# EAGLE schematic A-DSP V10 (EAGLE 7.6.0)
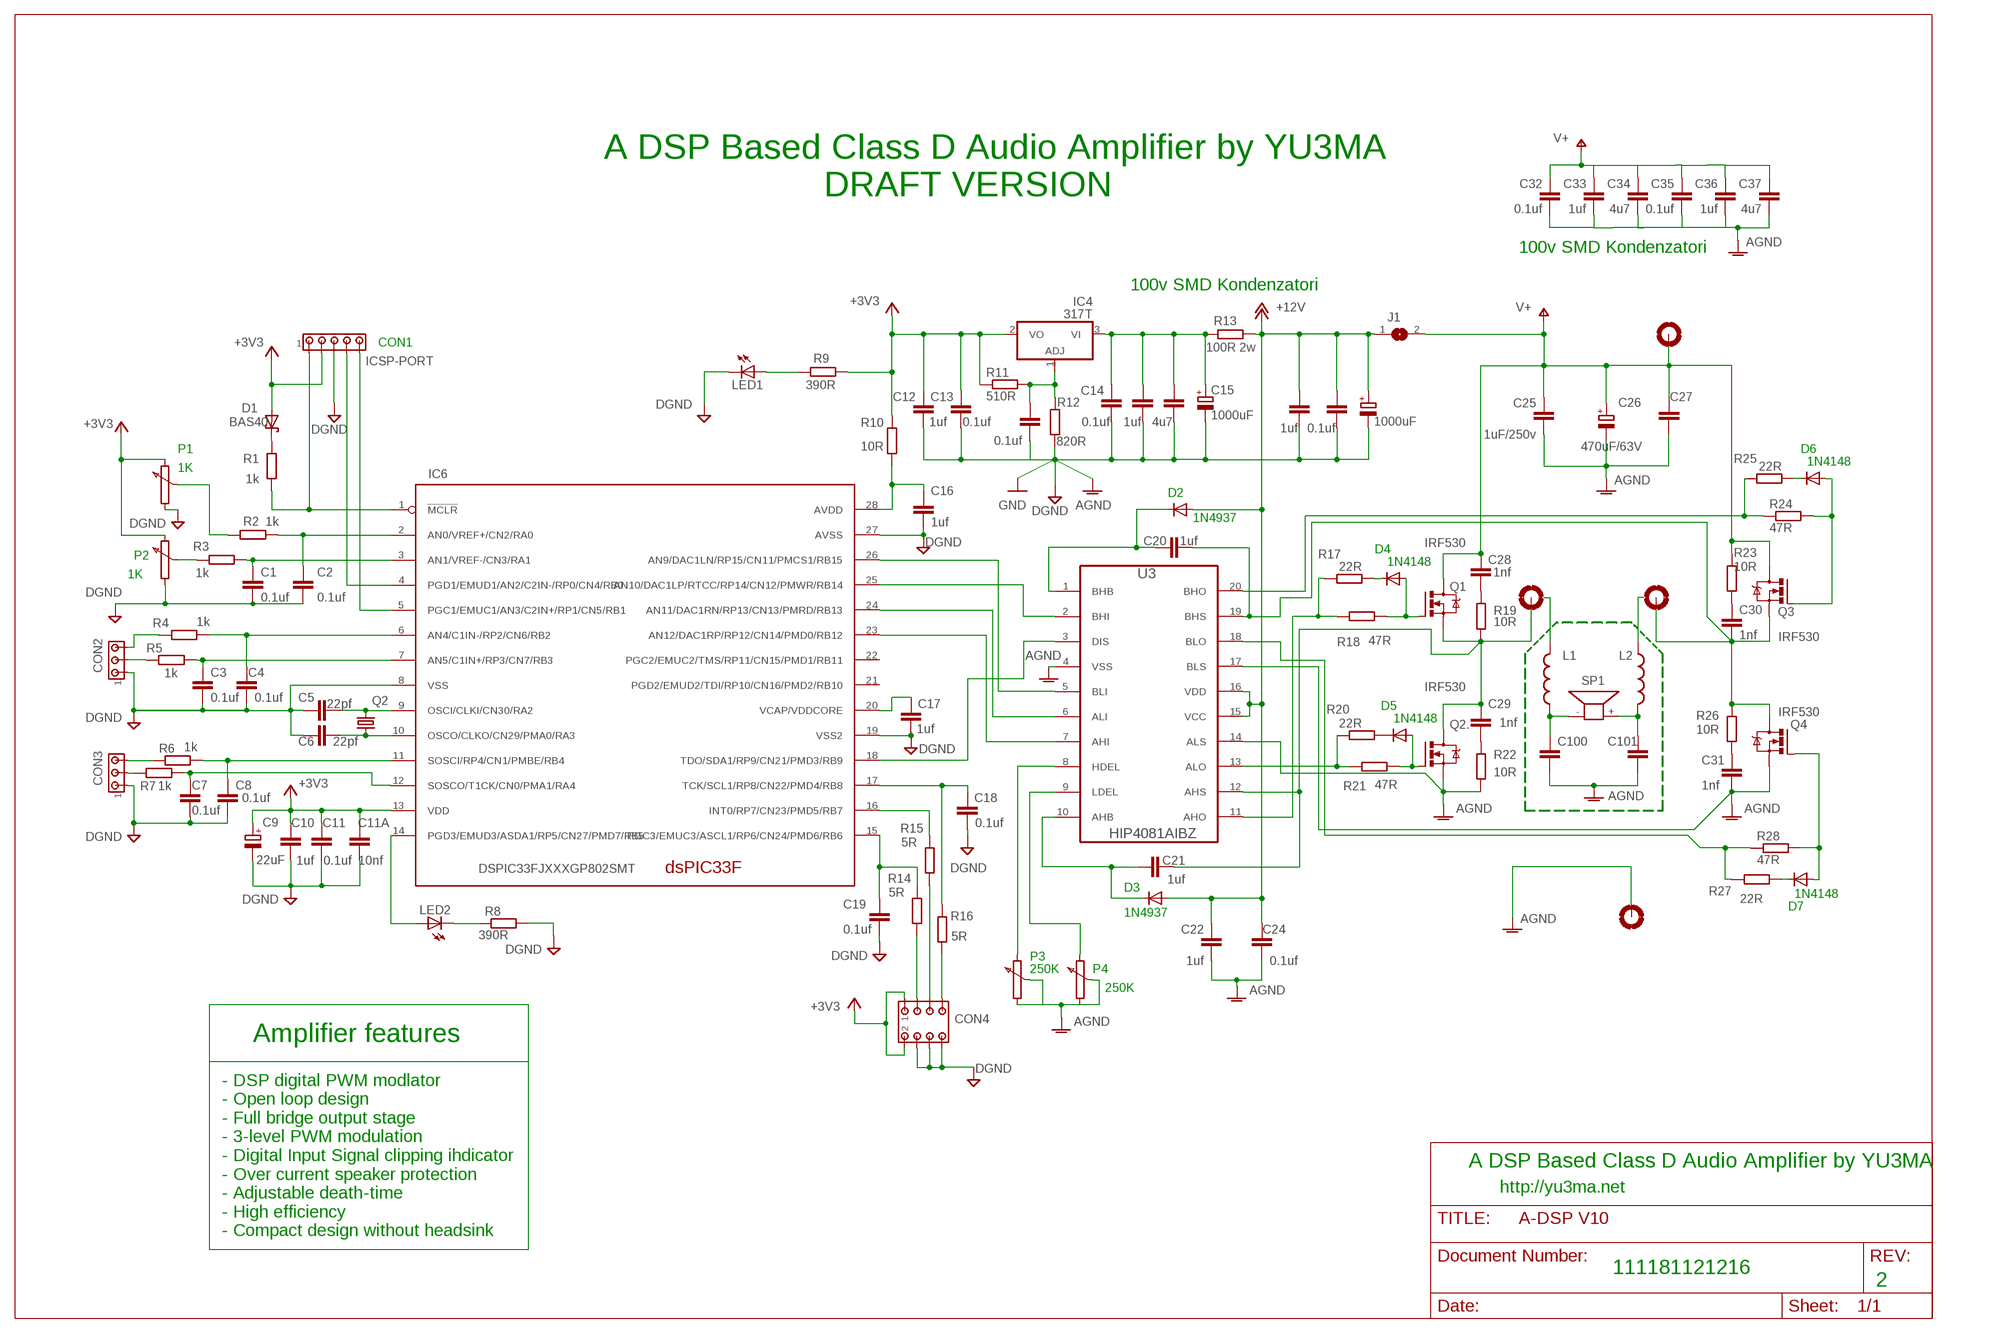
[diagram p0: schematic, sheet 1]

## Parts
C1  0.1uf  C2,5-3  [C2.5-3]
C2  0.1uf  C2,5-3  [C2.5-3]
C3  0.1uf  C2,5-3  [C2.5-3]
C4  0.1uf  C2,5-3  [C2.5-3]
C5  22pf  C2,5-3  [C2.5-3]
C6  22pf  C2,5-3  [C2.5-3]
C7  0.1uf  C2,5-3  [C2.5-3]
C8  0.1uf  C2,5-3  [C2.5-3]
C9  22uF  CPOL-EU085CS-1AR  [085CS_1AR]
C10  1uf  C2,5-3  [C2.5-3]
C11  0.1uf  C2,5-3  [C2.5-3]
C11A  10nf  C2,5-3  [C2.5-3]
C12  1uf  C2,5-3  [C2.5-3]
C13  0.1uf  C2,5-3  [C2.5-3]
C14  0.1uf  C2,5-3  [C2.5-3]
C15  1000uF  CPOL-EU085CS-1AR  [085CS_1AR]
C16  1uf  C2,5-3  [C2.5-3]
C17  1uf  C2,5-3  [C2.5-3]
C18  0.1uf  C2,5-3  [C2.5-3]
C19  0.1uf  C2,5-3  [C2.5-3]
C20  1uf  C2,5-3  [C2.5-3]
C21  1uf  C2,5-3  [C2.5-3]
C22  1uf  C2,5-3  [C2.5-3]
C23  0.1uf  C2,5-3  [C2.5-3]
C24  0.1uf  C2,5-3  [C2.5-3]
C25  1uF/250v  C2,5-3  [C2.5-3]
C26  470uF/63V  CPOL-EU085CS-1AR  [085CS_1AR]
C27  C2,5-3  [C2.5-3]
C28  1nf  C2,5-3  [C2.5-3]
C29  1nf  C2,5-3  [C2.5-3]
C30  1nf  C2,5-3  [C2.5-3]
C31  1nf  C2,5-3  [C2.5-3]
C32  0.1uf  C2,5-3  [C2.5-3]
C33  1uf  C2,5-3  [C2.5-3]
C34  4u7  C2,5-3  [C2.5-3]
C35  0.1uf  C2,5-3  [C2.5-3]
C36  1uf  C2,5-3  [C2.5-3]
C37  4u7  C2,5-3  [C2.5-3]
C38  1uf  C2,5-3  [C2.5-3]
C39  4u7  C2,5-3  [C2.5-3]
C40  1000uF  CPOL-EU085CS-1AR  [085CS_1AR]
C41  0.1uf  C2,5-3  [C2.5-3]
C42  1uf  C2,5-3  [C2.5-3]
C100  C2,5-3  [C2.5-3]
C101  C2,5-3  [C2.5-3]
CON2  350760-4  [350760-4]
CON3  350760-4  [350760-4]
CON4  794681-8  [794681-8]
D1  BAS40  [SOT23]
H1  MOUNT-PAD-ROUND2.8  [2,8-PAD]
H2  MOUNT-PAD-ROUND2.8  [2,8-PAD]
H3  MOUNT-PAD-ROUND2.8  [2,8-PAD]
H4  MOUNT-PAD-ROUND2.8  [2,8-PAD]
IC4  317T  [TO220H]
IC6  DSPIC33FJXXXGP802SMT  [SO28W]
ICSP-PORT  640466-1  [640466-1]
J1  SJ  [SJ]
L1  L-USTFI0410  [TFI0410]
L2  L-USTFI0410  [TFI0410]
LED1  LED3MM  [LED3MM]
LED2  LED3MM  [LED3MM]
Q1  IRF530  [TO220BV]
Q2  CRYSTALHC33U-V  [HC33U-V]
Q2.  IRF530  [TO220BV]
Q3  IRF530  [TO220BV]
Q4  IRF530  [TO220BV]
R1  1k  R-EU_0207/10  [0207/10]
R2  1k  R-EU_0207/10  [0207/10]
R3  1k  R-EU_0207/10  [0207/10]
R4  1k  R-EU_0207/10  [0207/10]
R5  1k  R-EU_0207/10  [0207/10]
R6  1k  R-EU_0207/10  [0207/10]
R7  1k  R-EU_0207/10  [0207/10]
R8  390R  R-EU_0207/10  [0207/10]
R9  390R  R-EU_0207/10  [0207/10]
R10  10R  R-EU_0207/10  [0207/10]
R11  510R  R-EU_0207/10  [0207/10]
R12  820R  R-EU_0207/10  [0207/10]
R13  100R 2w  R-EU_0207/10  [0207/10]
R14  5R  R-EU_0207/10  [0207/10]
R15  5R  R-EU_0207/10  [0207/10]
R16  5R  R-EU_0207/10  [0207/10]
R17  22R  R-EU_0207/10  [0207/10]
R18  47R  R-EU_0207/10  [0207/10]
R19  10R  R-EU_0207/10  [0207/10]
R20  22R  R-EU_0207/10  [0207/10]
R21  47R  R-EU_0207/10  [0207/10]
R22  10R  R-EU_0207/10  [0207/10]
R23  10R  R-EU_0207/10  [0207/10]
R24  47R  R-EU_0207/10  [0207/10]
R25  22R  R-EU_0207/10  [0207/10]
R26  10R  R-EU_0207/10  [0207/10]
R27  22R  R-EU_0207/10  [0207/10]
R28  47R  R-EU_0207/10  [0207/10]
SP1  AL11P  [AL11P]
U3  HIP4081AIBZ  [SOIC127P1032X265-20N]

## Nets
+3V3: C9.+ C10.2 C11.2 C11A.2 C12.2 C13.2 CON4.1 CON4.2 D1.1(A) IC4.2(VO) IC6.13(VDD) ICSP-PORT.2 R9.1 R10.1 R11.1
+12V: C22.2 C24.2 C40.+ C41.2 C42.2 J1.1 R13.1 U3.15(VCC) U3.16(VDD)
AGND: C22.1 C24.1 C25.1 C26.- C27.1 C31.2 C32.1 C33.1 C34.1 C35.1 C36.1 C37.1 C100.2 C101.2 H4.B2,8(MOUNT) Q2..S Q4.S R22.2 U3.4(VSS) U3.14(ALS) U3.17(BLS)
DGND: C1.1 C2.1 C3.1 C4.1 C5.1 C6.1 C7.1 C8.1 C9.- C10.1 C11.1 C11A.1 C12.1 C13.1 C14.1 C15.- C16.2 C17.1 C18.1 C19.1 C23.1 C38.1 C39.1 C40.- C41.1 C42.1 CON2.1 CON3.1 CON4.4 CON4.6 CON4.8 IC6.8(VSS) IC6.19(VSS2) IC6.27(AVSS) ICSP-PORT.3 LED1.K(C) R8.1 R12.1 ; supply symbol labelled AGND, GND
N$1: C101.1 L2.2 SP1.+
N$2: C100.1 L1.1 SP1.-
N$3: L1.2
N$5: C31.1 R26.1
N$6: Q4.G R28.2
N$7: Q1.G R18.2
N$8: R27.1 R28.1 U3.18(BLO)
N$9: C20.2 C30.2 H2.B2,8(MOUNT) Q3.S Q4.D R26.2 U3.19(BHS)
N$10: R24.1 R25.1 U3.20(BHO)
N$11: R17.1 R18.1 U3.11(AHO)
N$12: C30.1 R23.1
N$13: IC6.25(AN10/DAC1LP/RTCC/RP14/CN12/PMWR/RB14) U3.2(BHI)
N$14: L2.1
N$15: C21.2 C29.2 H1.B2,8(MOUNT) Q1.S Q2..D R19.2 U3.12(AHS)
N$16: C28.1 R19.1
N$18: C20.1 U3.1(BHB)
N$19: C14.2 C15.+ C38.2 C39.2 IC4.3(VI) R13.2
N$20: C29.1 R22.1
N$21: Q2..G R21.1
N$22: C21.1 U3.10(AHB)
N$23: IC6.26(AN9/DAC1LN/RP15/CN11/PMCS1/RB15) U3.5(BLI)
N$24: IC6.24(AN11/DAC1RN/RP13/CN13/PMRD/RB13) U3.6(ALI)
N$25: C23.2 IC4.1(ADJ) R11.2 R12.2
N$26: IC6.23(AN12/DAC1RP/RP12/CN14/PMD0/RB12) U3.7(AHI)
N$27: IC6.18(TDO/SDA1/RP9/CN21/PMD3/RB9) U3.3(DIS)
N$28: C17.2 IC6.20(VCAP/VDDCORE)
N$29: U3.8(HDEL)
N$30: U3.9(LDEL)
N$32: C6.2 IC6.10(OSCO/CLKO/CN29/PMA0/RA3) Q2.2
N$33: C16.1 IC6.28(AVDD) R10.2
N$34: C5.2 IC6.9(OSCI/CLKI/CN30/RA2) Q2.1
N$35: IC6.5(PGC1/EMUC1/AN3/C2IN+/RP1/CN5/RB1) ICSP-PORT.5
N$36: IC6.4(PGD1/EMUD1/AN2/C2IN-/RP0/CN4/RB0) ICSP-PORT.4
N$37: C2.2 IC6.2(AN0/VREF+/CN2/RA0) R2.1
N$38: IC6.1(!MCLR) ICSP-PORT.1 R1.1
N$39: C1.2 IC6.3(AN1/VREF-/CN3/RA1) R3.2
N$40: D1.3(C) R1.2
N$41: R3.1
N$42: R2.2
N$43: CON3.3 R6.2
N$44: LED1.A R9.2
N$45: C8.2 IC6.11(SOSCI/RP4/CN1/PMBE/RB4) R6.1
N$47: CON2.3 R4.2
N$48: R25.2
N$49: CON2.2 R5.2
N$50: C7.2 IC6.12(SOSCO/T1CK/CN0/PMA1/RA4) R7.1
N$51: IC6.14(PGD3/EMUD3/ASDA1/RP5/CN27/PMD7/RB5) LED2.A
N$52: LED2.K(C) R8.2
N$53: CON4.3 R14.1
N$54: CON4.5 R15.1
N$55: C19.2 IC6.15(PGC3/EMUC3/ASCL1/RP6/CN24/PMD6/RB6) R14.2
N$56: IC6.16(INT0/RP7/CN23/PMD5/RB7) R15.2
N$57: C18.2 IC6.17(TCK/SCL1/RP8/CN22/PMD4/RB8) R16.2
N$58: CON4.7 R16.1
N$59: C3.2 IC6.7(AN5/C1IN+/RP3/CN7/RB3) R5.1
N$60: C4.2 IC6.6(AN4/C1IN-/RP2/CN6/RB2) R4.1
N$61: Q3.G R24.2
N$62: R27.2
N$63: R20.1 R21.2 U3.13(ALO)
N$64: CON3.2 R7.2
N$67: R17.2
V+: C25.2 C26.+ C27.2 C28.2 C32.2 C33.2 C34.2 C35.2 C36.2 C37.2 H3.B2,8(MOUNT) J1.2 Q1.D Q3.D R23.2
Unconnected: IC6.21(PGD2/EMUD2/TDI/RP10/CN16/PMD2/RB10) IC6.22(PGC2/EMUC2/TMS/RP11/CN15/PMD1/RB11) R20.2

## Notes on the sheet
- A DSP Based Class D Audio Amplifier by YU3MA
                        DRAFT VERSION
- 100v SMD Kondenzatori
- 100v SMD Kondenzatori
- CON1
- P1 | D6
- 1N4148
- 1K
- D2
- 1N4937
- D4
- P2
- 1N4148
- 1K
- D5
- 1N4148
- D3
- 1N4148
- D7
- 1N4937
- P3
- 250K | P4
- 250K
- Amplifier features
- A DSP Based Class D Audio Amplifier by YU3MA
- http://yu3ma.net
- - DSP digital PWM modlator
  - Open loop design
  - Full bridge output stage
  - 3-level PWM modulation
  - Digital Input Signal clipping ihdicator
  - Over current speaker protection
  - Adjustable death-time
  - High efficiency
  - Compact design without headsink
- 111181121216
- 2

## Library data of the parts
C1-C8 C10 C11 C11A C12-C14 C16-C25 C27-C39 C41 C42 C100 C101 = capacitor-wima:C: CAPACITOR naming: grid - package width
C9 C15 C26 C40 = rcl:CPOL-EU: POLARIZED CAPACITOR, European symbol
CON2 CON3 = con-amp:350760-4: Universal MATE-N-LOK .250" Centerline, 600 V, 19 - 36 A max Source: http://catalog.tycoelectronics.com/ .. ENG_CD_350760_T.pdf
CON4 = con-amp:794681-8: Micro MATE-N-LOK Connectors grid 1.5mm Dual Row Through Hole Vertical Metal Through Hole Holddowns Source: ENG_CD_794681_E.pdf
D1 = diode:BAS40: Silicon Schottky Diodes General-purpose diode for high-speed switching
H1-H4 = holes:MOUNT-PAD-ROUND: MOUNTING PAD, round
IC4 = linear:*317: Positive VOLTAGE REGULATOR
IC6 = dspic33:DSPIC33FJXXXGP802: High-Performance, 16-bit Digital Signal Controllers - dsPIC33FJ64GP802 & dsPIC33FJ128GP802 Source: http://ww1.microchip.com/downloads/en/DeviceDoc/70292B.pdf Operating Range: . Up to 40 MIPS operation (at 3.0-3.6V): - Industrial temperature range (-40°C to +85°C) - Extended temperature range (-40°C to +125°C) High-Performance DSC CPU: . Modified Harvard architecture . C compiler optimized instruction set . 16-bit wide data path . 24-bit wide instructions . Linear program memory addressing up to 4M instruction words . Linear data memory addressing up to 64 Kbytes . 83 base instructions: mostly 1 word/1 cycle . Two 40-bit accumulators with rounding and saturation options . Flexible and powerful addressing modes: - Indirect - Modulo - Bit-Reversed . Software stack . 16 x 16 fractional/integer multiply operations . 32/16 and 16/16 divide operations . Single-cycle multiply and accumulate: - Accumulator write back for DSP operations - Dual data fetch . Up to ±16-bit shifts for up to 40-bit data On-Chip Flash and SRAM: . Flash program memory . Data SRAM . Boot, Secure, and General Security for program Flash Direct Memory Access (DMA): . 8-channel hardware DMA . Up to 2 Kbytes dual ported DMA buffer area (DMA RAM) to store data transferred via DMA: - Allows data transfer between RAM and a peripheral while CPU is executing code (no cycle stealing) . Most peripherals support DMA Timers/Capture/Compare/PWM: . Timer/Counters, up to five 16-bit timers: - Can pair up to make two 32-bit timers - One timer runs as a Real-Time Clock with an external 32.768 kHz oscillator - Programmable prescaler . Input Capture (up to four channels): - Capture on up, down or both edges - 16-bit capture input functions - 4-deep FIFO on each capture . Output Compare (up to four channels): - Single or Dual 16-bit Compare mode - 16-bit Glitchless PWM mode . Hardware Real-Time Clock/Calendar (RTCC): - Provides clock, calendar, and alarm functions Interrupt Controller: . 5-cycle latency . 118 interrupt vectors . Up to 49 available interrupt sources . Up to three external interrupts . Seven programmable priority levels . Five processor exceptions Digital I/O: . Peripheral pin Select functionality . Up to 35 programmable digital I/O pins . Wake-up/Interrupt-on-Change for up to 21 pins . Output pins can drive from 3.0V to 3.6V . Up to 5V output with open drain configuration . All digital input pins are 5V tolerant . 4 mA sink on all I/O pins System Management: . Flexible clock options: - External, crystal, resonator, internal RC - Fully integrated Phase-Locked Loop (PLL) - Extremely low jitter PLL . Power-up Timer . Oscillator Start-up Timer/Stabilizer . Watchdog Timer with its own RC oscillator . Fail-Safe Clock Monitor . Reset by multiple sources Power Management: . On-chip 2.5V voltage regulator . Switch between clock sources in real time . Idle, Sleep, and Doze modes with fast wake-up Analog-to-Digital Converters (ADCs): . 10-bit, 1.1 Msps or 12-bit, 500 Ksps conversion: - Two and four simultaneous samples (10-bit ADC) - Up to 13 input channels with auto-scanning - Conversion start can be manual or synchronized with one of four trigger sources - Conversion possible in Sleep mode - ±2 LSb max integral nonlinearity - ±1 LSb max differential nonlinearity Audio Digital-to-Analog Converter (DAC): . 16-bit Dual Channel DAC module . 100 Ksps maximum sampling rate . Second-Order Digital Delta-Sigma Modulator Data Converter Interface (DCI) module: . Codec interface . Supports I2S and AC.97 protocols . Up to 16-bit data words, up to 16 words per frame . 4-word deep TX and RX buffers Comparator Module: . Two analog comparators with programmable input/output configuration CMOS Flash Technology: . Low-power, high-speed Flash technology . Fully static design . 3.3V (±10%) operating voltage . Industrial and Extended temperature . Low power consumption Communication Modules: . 4-wire SPI (up to two modules): - Framing supports I/O interface to simple codecs - Supports 8-bit and 16-bit data - Supports all serial clock formats and sampling modes . I2C?: - Full Multi-Master Slave mode support - 7-bit and 10-bit addressing - Bus collision detection and arbitration - Integrated signal conditioning - Slave address masking . UART (up to two modules): - Interrupt on address bit detect - Interrupt on UART error - Wake-up on Start bit from Sleep mode - 4-character TX and RX FIFO buffers - LIN bus support - IrDA® encoding and decoding in hardware - High-Speed Baud mode - Hardware Flow Control with CTS and RTS . Enhanced CAN (ECAN. module) 2.0B active: - Up to eight transmit and up to 32 receive buffers - 16 receive filters and three masks - Loopback, Listen Only and Listen All - Messages modes for diagnostics and bus monitoring - Wake-up on CAN message - Automatic processing of Remote Transmission Requests - FIFO mode using DMA - DeviceNet. addressing support . Parallel Master Slave Port (PMP/EPSP): - Supports 8-bit or 16-bit data - Supports 16 address lines . Programmable Cyclic Redundancy Check (CRC): - Programmable bit length for the CRC generator polynomial (up to 16-bit length) - 8-deep, 16-bit or 16-deep, 8-bit FIFO for data input
ICSP-PORT = con-amp:640466-1: Universal MATE-N-LOK .250" Centerline, 600 V, 19 - 36 A max Source: http://catalog.tycoelectronics.com/ .. ENG_CD_640466_M.pdf
J1 = jumper:SJ: SMD solder JUMPER
L1 L2 = rcl:L-US: INDUCTOR, American symbol
LED1 LED2 = led:LED: LED OSRAM: - CHIPLED LG R971, LG N971, LY N971, LG Q971, LY Q971, LO R971, LY R971 LH N974, LH R974 LS Q976, LO Q976, LY Q976 LO Q996 - Hyper CHIPLED LW Q18S LB Q993, LB Q99A, LB R99A - SideLED LS A670, LO A670, LY A670, LG A670, LP A670 LB A673, LV A673, LT A673, LW A673 LH A674 LY A675 LS A676, LA A676, LO A676, LY A676, LW A676 LS A679, LY A679, LG A679 - Hyper Micro SIDELED® LS Y876, LA Y876, LO Y876, LY Y876 LT Y87S - SmartLED LW L88C, LW L88S LB L89C, LB L89S, LG L890 LS L89K, LO L89K, LY L89K LS L896, LA L896, LO L896, LY L896 - TOPLED LS T670, LO T670, LY T670, LG T670, LP T670 LSG T670, LSP T670, LSY T670, LOP T670, LYG T670 LG T671, LOG T671, LSG T671 LB T673, LV T673, LT T673, LW T673 LH T674 LS T676, LA T676, LO T676, LY T676, LB T676, LH T676, LSB T676, LW T676 LB T67C, LV T67C, LT T67C, LS T67K, LO T67K, LY T67K, LW E67C LS E67B, LA E67B, LO E67B, LY E67B, LB E67C, LV E67C, LT E67C LW T67C LS T679, LY T679, LG T679 LS T770, LO T770, LY T770, LG T770, LP T770 LB T773, LV T773, LT T773, LW T773 LH T774 LS E675, LA E675, LY E675, LS T675 LS T776, LA T776, LO T776, LY T776, LB T776 LHGB T686 LT T68C, LB T68C - Hyper Mini TOPLED® LB M676 - Mini TOPLED Santana® LG M470 LS M47K, LO M47K, LY M47K Source: http://www.osram.convergy.de LUXEON: - LUMILED® LXK2-PW12-R00, LXK2-PW12-S00, LXK2-PW14-U00, LXK2-PW14-V00 LXK2-PM12-R00, LXK2-PM12-S00, LXK2-PM14-U00 LXK2-PE12-Q00, LXK2-PE12-R00, LXK2-PE12-S00, LXK2-PE14-T00, LXK2-PE14-U00 LXK2-PB12-K00, LXK2-PB12-L00, LXK2-PB12-M00, LXK2-PB14-N00, LXK2-PB14-P00, LXK2-PB14-Q00 LXK2-PR12-L00, LXK2-PR12-M00, LXK2-PR14-Q00, LXK2-PR14-R00 LXK2-PD12-Q00, LXK2-PD12-R00, LXK2-PD12-S00 LXK2-PH12-R00, LXK2-PH12-S00 LXK2-PL12-P00, LXK2-PL12-Q00, LXK2-PL12-R00 Source: www.luxeon.com KINGBRIGHT: KA-3528ASYC Source: www.kingbright.com
Q1 Q2. Q3 Q4 = transistor-power:IRF530: HEXFET Power MOSFET
Q2 = crystal:CRYSTAL: CRYSTAL; OC_FARNELL: unknown; OC_NEWARK: unknown
R1-R28 = resistor:R-EU_: RESISTOR, European symbol
SP1 = buzzer:AL11P: SPEAKER Source: Buerklin; OC_FARNELL: unknown; OC_NEWARK: unknown
U3 = Intersil_By_element14_Batch_1:HIP4081AIBZ: 80V/2.5A Peak, High Frequency Full Bridge FET Driver; MPN: HIP4081AIBZ; OC_FARNELL: 1561934; OC_NEWARK: 57K3816; PACKAGE: SOIC-20; SUPPLIER: Intersil